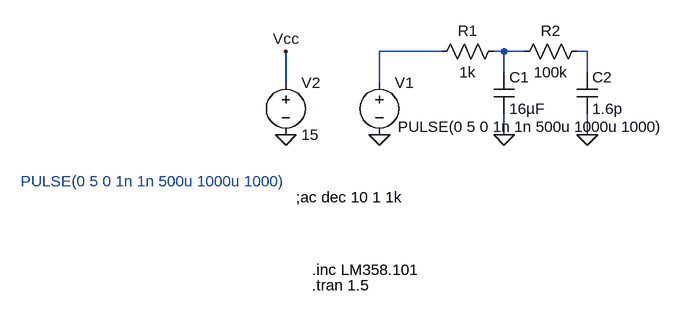
[diagram p0: schematic dac.asc]
dac.asc, the LTspice schematic file:
Version 4
SHEET 1 880 680
WIRE -112 112 -208 112
WIRE -16 112 -32 112
WIRE 16 112 -16 112
WIRE 112 112 96 112
WIRE -16 144 -16 112
WIRE 112 144 112 112
WIRE -352 160 -352 112
WIRE -208 160 -208 112
WIRE -16 240 -16 208
WIRE 112 240 112 208
FLAG -208 240 0
FLAG -16 240 0
FLAG 112 240 0
FLAG -352 240 0
FLAG -352 112 Vcc
SYMBOL voltage -208 144 R0
WINDOW 3 -136 161 Left 2
WINDOW 123 29 84 Left 2
WINDOW 39 0 0 Left 2
SYMATTR Value ""
SYMATTR Value2 PULSE(0 5 0 1n 1n 500u 1000u 1000)
SYMATTR InstName V1
SYMBOL res -16 96 R90
WINDOW 0 0 56 VBottom 2
WINDOW 3 32 56 VTop 2
SYMATTR InstName R1
SYMATTR Value 1k
SYMBOL res 112 96 R90
WINDOW 0 0 56 VBottom 2
WINDOW 3 32 56 VTop 2
SYMATTR InstName R2
SYMATTR Value 100k
SYMBOL cap -32 144 R0
SYMATTR InstName C1
SYMATTR Value 16µF
SYMBOL cap 96 144 R0
SYMATTR InstName C2
SYMATTR Value 1.6p
SYMBOL voltage -352 144 R0
WINDOW 123 0 0 Left 2
WINDOW 39 0 0 Left 2
SYMATTR InstName V2
SYMATTR Value 15
TEXT -312 448 Left 2 !.inc LM358.101
TEXT -312 472 Left 2 !.tran 1.5
TEXT -336 336 Left 2 !;ac dec 10 1 1k
TEXT -760 312 Left 2 ;PULSE(0 5 0 1n 1n 500u 1000u 1000)

The netlist it stands for:
* dac.asc
V1 N001 0 PULSE(0 5 0 1n 1n 500u 1000u 1000)
R1 N002 N001 1k
R2 N003 N002 100k
C1 N002 0 16µF
C2 N003 0 1.6p
V2 Vcc 0 15
.inc LM358.101
.tran 1.5
;ac dec 10 1 1k
* PULSE(0 5 0 1n 1n 500u 1000u 1000)
.backanno
.end